# EAGLE design ECE411 Haptic Compass (EAGLE 9.5.1)
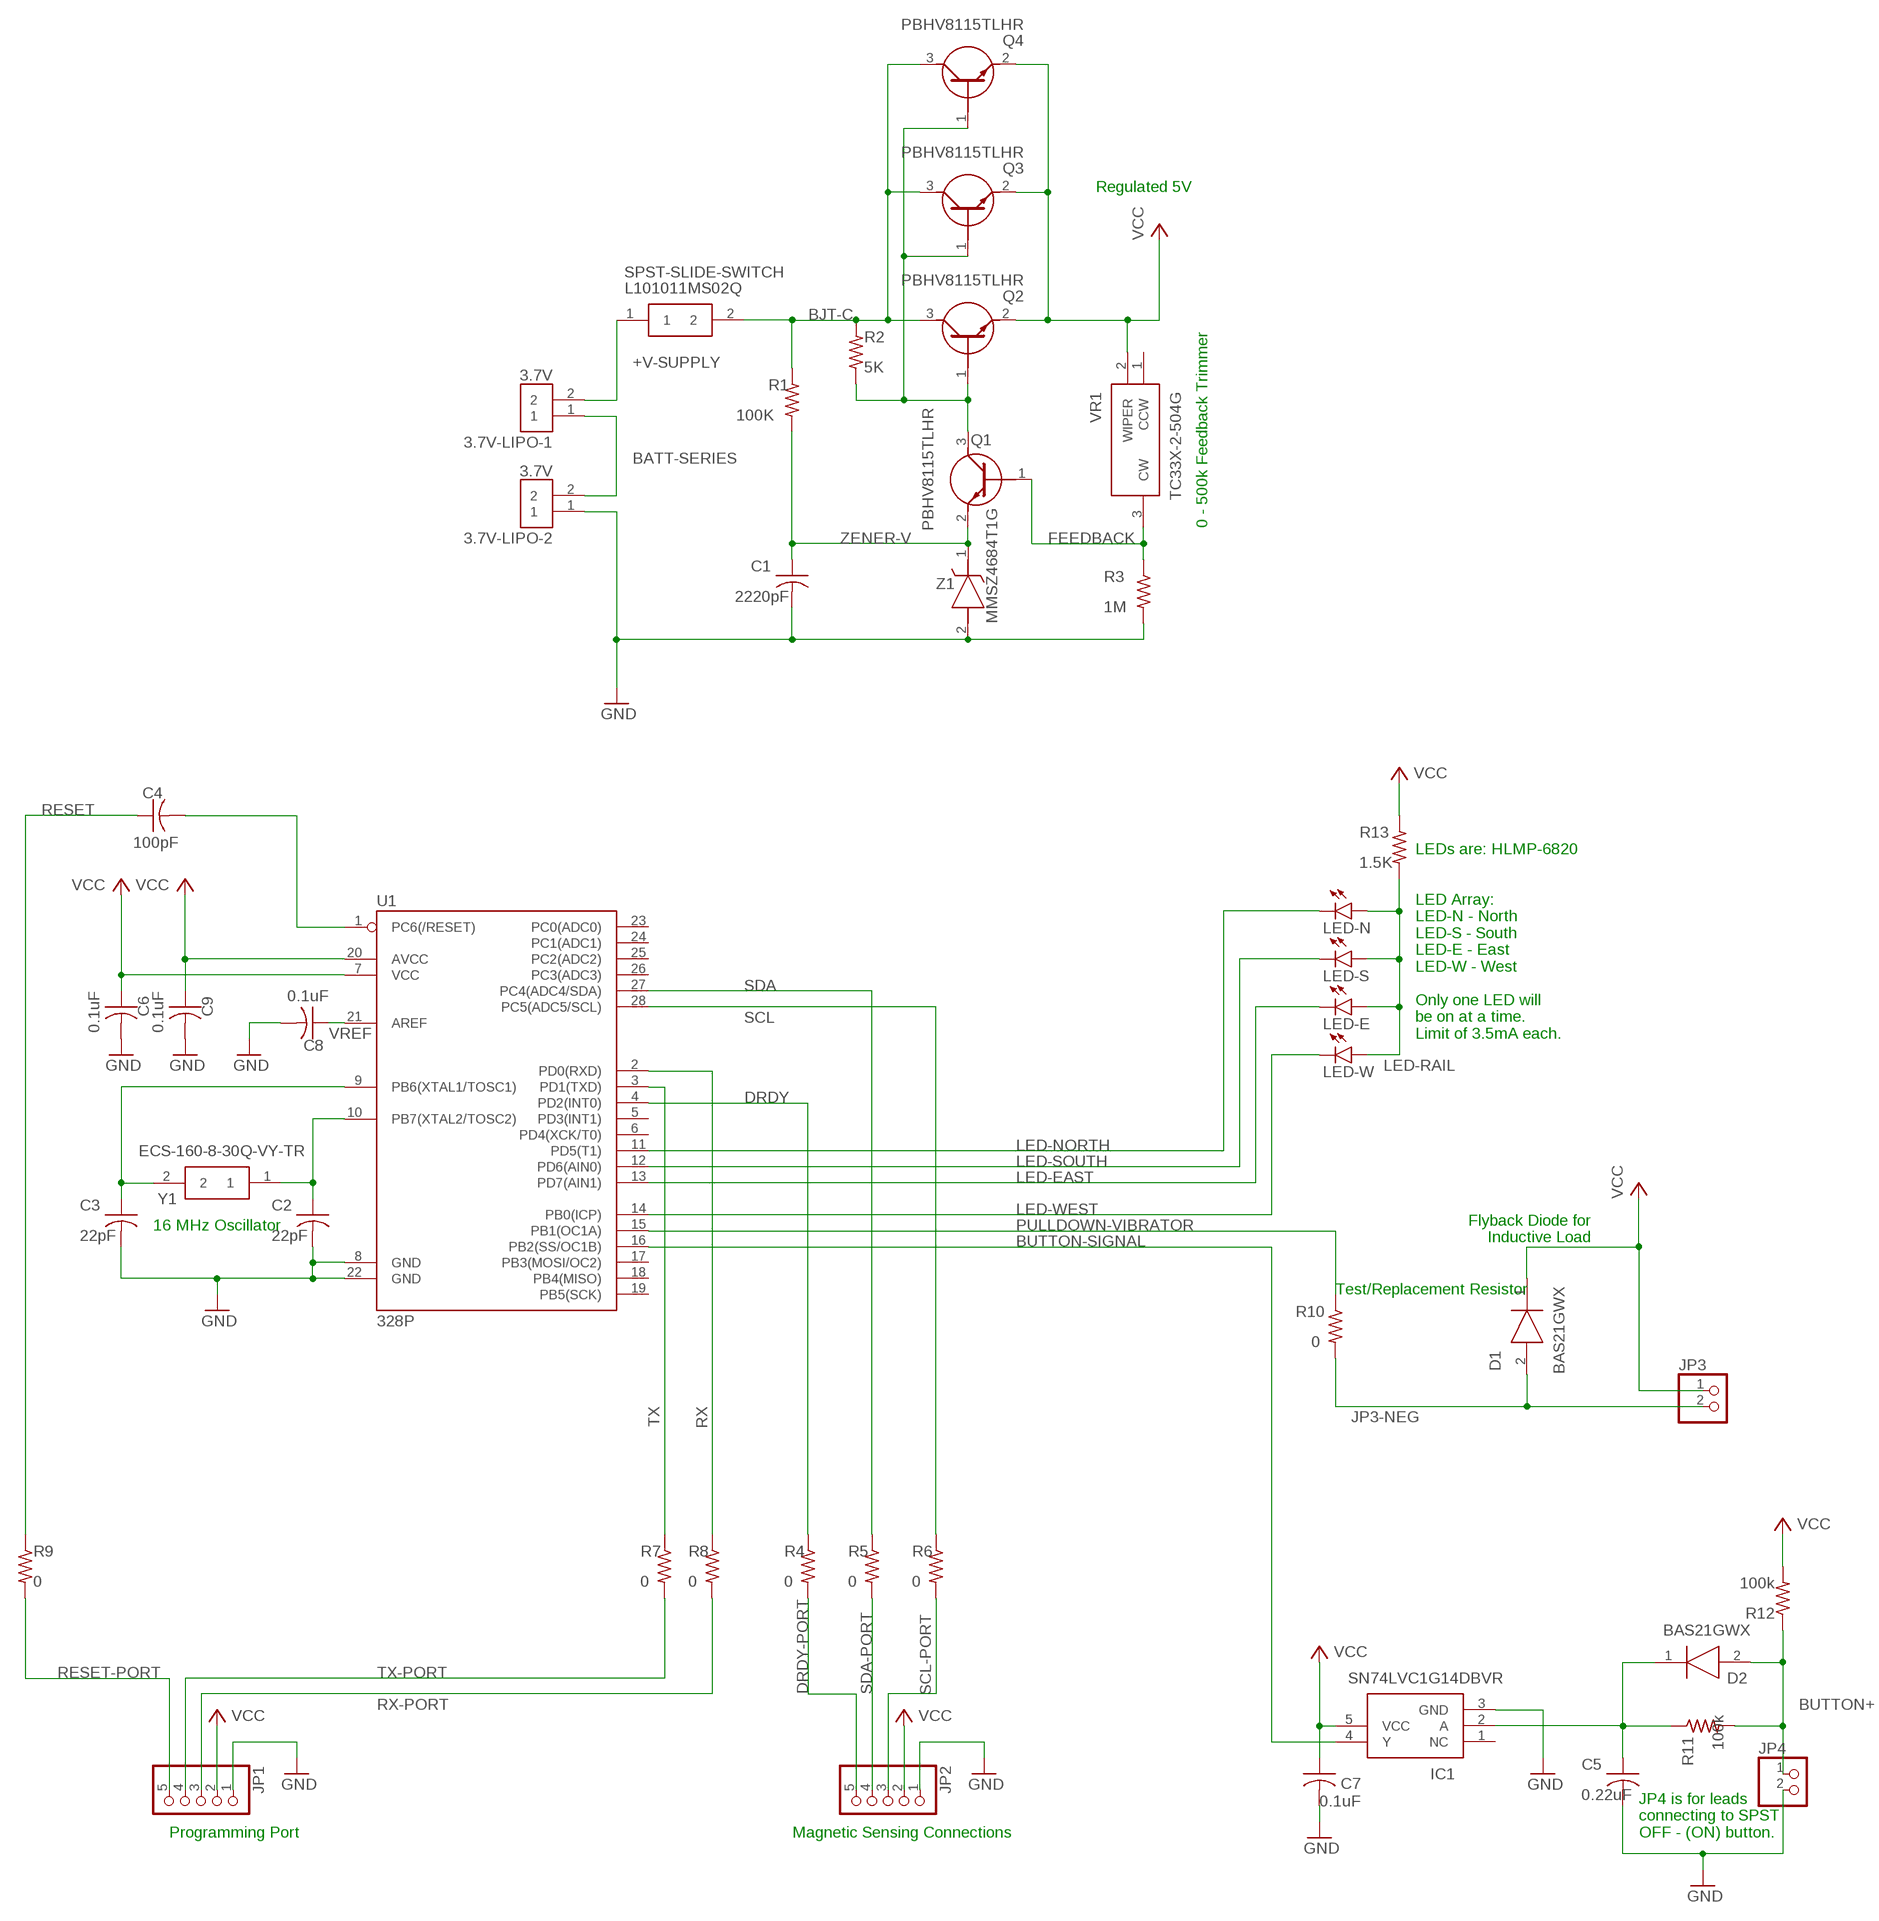
[diagram p0: schematic, sheet 1]

## Parts
3.7V-LIPO-1  3.7V  S2B-PH-K-S(LF)(SN)  [JST_S2B-PH-K-S(LF)(SN)]
3.7V-LIPO-2  3.7V  S2B-PH-K-S(LF)(SN)  [JST_S2B-PH-K-S(LF)(SN)]
C1  2220pF  C-USC0805  [C0805]
C2  22pF  C-USC0805  [C0805]
C3  22pF  C-USC0805  [C0805]
C4  100pF  C-USC0805  [C0805]
C5  0.22uF  C-USC0805  [C0805]
C6  0.1uF  C-USC0805  [C0805]
C7  0.1uF  C-USC0805  [C0805]
C8  0.1uF  C-USC0805  [C0805]
C9  0.1uF  C-USC0805  [C0805]
D1  BAS21GWX  [SOD3616X130N]
D2  BAS21GWX  [SOD3616X130N]
IC1  SN74LVC1G14DBVR  [SOT95P280X145-5N]
JP1  PINHD-1X5  [1X05]
JP2  PINHD-1X5  [1X05]
JP3  PINHD-1X2  [1X02]
JP4  PINHD-1X2  [1X02]
LED-E  LED5MM  [LED5MM]
LED-N  LED5MM  [LED5MM]
LED-S  LED5MM  [LED5MM]
LED-W  LED5MM  [LED5MM]
Q1  PBHV8115TLHR  [SOT95P230X110-3N]
Q2  PBHV8115TLHR  [SOT95P230X110-3N]
Q3  PBHV8115TLHR  [SOT95P230X110-3N]
Q4  PBHV8115TLHR  [SOT95P230X110-3N]
R1  100K  R-US_R0805  [R0805]
R2  5K  R-US_R0805  [R0805]
R3  1M  R-US_R0805  [R0805]
R4  0  R-US_R0805  [R0805]
R5  0  R-US_R0805  [R0805]
R6  0  R-US_R0805  [R0805]
R7  0  R-US_R0805  [R0805]
R8  0  R-US_R0805  [R0805]
R9  0  R-US_R0805  [R0805]
R10  0  R-US_R0805  [R0805]
R11  100k  R-US_R0805  [R0805]
R12  100k  R-US_R0805  [R0805]
R13  1.5K  R-US_R0805  [R0805]
SPST-SLIDE-SWITCH  L101011MS02Q  [CKC5106-ND]
U1  328P  ATMEGA328P_PDIP  [DIP28]
VR1  TC33X-2-504G  [TC33X-2_1]
Y1  ECS-160-8-30Q-VY-TR  [ECS80830QVSTR]
Z1  MMSZ4684T1G  [SOD3716X135N]

## Nets
+V-SUPPLY: 3.7V-LIPO-1.2 SPST-SLIDE-SWITCH.1
BATT-SERIES: 3.7V-LIPO-1.1 3.7V-LIPO-2.2
BJT-C: Q2.3(C) Q3.3(C) Q4.3(C) R1.1 R2.1 SPST-SLIDE-SWITCH.2
BUTTON+: D2.2(A) JP4.1 R11.2 R12.1
BUTTON-SIGNAL: IC1.4(Y) U1.16(PB2(SS/OC1B))
DRDY: R4.1 U1.4(PD2(INT0))
DRDY-PORT: JP2.5 R4.2
FEEDBACK: Q1.1(B) R3.1 VR1.3(CW)
GND: 3.7V-LIPO-2.1 C1.2 C2.2 C3.2 C5.2 C6.2 C7.2 C8.2 C9.2 IC1.3(GND) JP1.1 JP2.1 JP4.2 R3.2 U1.8(GND) U1.22(GND) Z1.2(A)
JP3-NEG: D1.2(A) JP3.2 R10.2
LED-EAST: LED-E.K(C) U1.13(PD7(AIN1))
LED-NORTH: LED-N.K(C) U1.11(PD5(T1))
LED-RAIL: LED-E.A LED-N.A LED-S.A LED-W.A R13.2
LED-SOUTH: LED-S.K(C) U1.12(PD6(AIN0))
LED-WEST: LED-W.K(C) U1.14(PB0(ICP))
N$1: C4.2 U1.1(PC6(/RESET))
N$3: C5.1 D2.1(K) IC1.2(A) R11.1
N$5: C2.1 U1.10(PB7(XTAL2/TOSC2)) Y1.1
N$7: C3.1 U1.9(PB6(XTAL1/TOSC1)) Y1.2
N$9: Q1.3(C) Q2.1(B) Q3.1(B) Q4.1(B) R2.2
PULLDOWN-VIBRATOR: R10.1 U1.15(PB1(OC1A))
RESET: C4.1 R9.1
RESET-PORT: JP1.5 R9.2
RX: R8.1 U1.2(PD0(RXD))
RX-PORT: JP1.3 R8.2
SCL: R6.1 U1.28(PC5(ADC5/SCL))
SCL-PORT: JP2.3 R6.2
SDA: R5.1 U1.27(PC4(ADC4/SDA))
SDA-PORT: JP2.4 R5.2
TX: R7.1 U1.3(PD1(TXD))
TX-PORT: JP1.4 R7.2
VCC: C6.1 C7.1 C9.1 D1.1(K) IC1.5(VCC) JP1.2 JP2.2 JP3.1 Q2.2(E) Q3.2(E) Q4.2(E) R12.2 R13.1 U1.7(VCC) U1.20(AVCC) VR1.2(WIPER)
VREF: C8.1 U1.21(AREF)
ZENER-V: C1.1 Q1.2(E) R1.2 Z1.1(K)
Unconnected: IC1.1(NC) U1.5(PD3(INT1)) U1.6(PD4(XCK/T0)) U1.17(PB3(MOSI/OC2)) U1.18(PB4(MISO)) U1.19(PB5(SCK)) U1.23(PC0(ADC0)) U1.24(PC1(ADC1)) U1.25(PC2(ADC2)) U1.26(PC3(ADC3)) VR1.1(CCW)

## Notes on the sheet
- Regulated 5V
- 0 - 500k Feedback Trimmer
- LEDs are: HLMP-6820
  
  
  LED Array:
  LED-N - North
  LED-S - South
  LED-E - East
  LED-W - West
  
  Only one LED will
  be on at a time.
  Limit of 3.5mA each.
- Flyback Diode for
  Inductive Load
- 16 MHz Oscillator
- Test/Replacement Resistor
- Programming Port | Magnetic Sensing Connections
- JP4 is for leads
  connecting to SPST
  OFF - (ON) button.

## Library data of the parts
3.7V-LIPO-1 3.7V-LIPO-2 = S2B-PH-K-S_LF__SN_:S2B-PH-K-S(LF)(SN): PH Series 2 Position 2.0 mm Through Hole Side Entry Shrouded Header; DESCRIPTION: PH Series 2 Position 2.0 mm Through Hole Side Entry Shrouded Header; DIGI-KEY_PART_NUMBER: 455-1719-ND; DIGI-KEY_PURCHASE_URL: https://www.digikey.com/product-detail/en/jst-sales-america-inc/S2B-PH-K-S_LF__SN_/455-1719-ND/926626?utm_source=snapeda&utm_medium=aggregator&utm_campaign=symbol; MF: JST Sales; MP: S2B-PH-K-S_LF__SN_; PACKAGE: None
C1-C9 = rcl:C-US: CAPACITOR, American symbol; SPICEPREFIX: C
D1 D2 = SamacSys_Parts:BAS21GWX: Diodes - General Purpose, Power, Switching High-voltage switching diode - 3k Reel Source: Datasheet <https://componentsearchengine.com/Datasheets/1/BAS21GWX.pdf>; DESCRIPTION: Diodes - General Purpose, Power, Switching High-voltage switching diode - 3k Reel; HEIGHT: 1.3mm; MANUFACTURER_NAME: Nexperia; MANUFACTURER_PART_NUMBER: BAS21GWX; MOUSER_PART_NUMBER: 841-BAS21GWX; MOUSER_PRICE-STOCK: https://www.mouser.com/Search/Refine.aspx?Keyword=841-BAS21GWX
IC1 = SamacSys_Parts:SN74LVC1G14DBVR: TEXAS INSTRUMENTS - SN74LVC1G14DBVR - IC, SCHMITT TRIGGER INVERTER, SMD Source: Datasheet; DESCRIPTION: TEXAS INSTRUMENTS - SN74LVC1G14DBVR - IC, SCHMITT TRIGGER INVERTER, SMD; HEIGHT: 1.45mm; MANUFACTURER_NAME: Texas Instruments; MANUFACTURER_PART_NUMBER: SN74LVC1G14DBVR; MOUSER_PART_NUMBER: 595-SN74LVC1G14DBVR; MOUSER_PRICE-STOCK: https://www.mouser.com/Search/Refine.aspx?Keyword=595-SN74LVC1G14DBVR
JP1 JP2 = pinhead:PINHD-1X5: PIN HEADER
JP3 JP4 = pinhead:PINHD-1X2: PIN HEADER
LED-E LED-N LED-S LED-W = led:LED: LED OSRAM: - CHIPLED LG R971, LG N971, LY N971, LG Q971, LY Q971, LO R971, LY R971 LH N974, LH R974 LS Q976, LO Q976, LY Q976 LO Q996 - Hyper CHIPLED LW Q18S LB Q993, LB Q99A, LB R99A - SideLED LS A670, LO A670, LY A670, LG A670, LP A670 LB A673, LV A673, LT A673, LW A673 LH A674 LY A675 LS A676, LA A676, LO A676, LY A676, LW A676 LS A679, LY A679, LG A679 - Hyper Micro SIDELED® LS Y876, LA Y876, LO Y876, LY Y876 LT Y87S - SmartLED LW L88C, LW L88S LB L89C, LB L89S, LG L890 LS L89K, LO L89K, LY L89K LS L896, LA L896, LO L896, LY L896 - TOPLED LS T670, LO T670, LY T670, LG T670, LP T670 LSG T670, LSP T670, LSY T670, LOP T670, LYG T670 LG T671, LOG T671, LSG T671 LB T673, LV T673, LT T673, LW T673 LH T674 LS T676, LA T676, LO T676, LY T676, LB T676, LH T676, LSB T676, LW T676 LB T67C, LV T67C, LT T67C, LS T67K, LO T67K, LY T67K, LW E67C LS E67B, LA E67B, LO E67B, LY E67B, LB E67C, LV E67C, LT E67C LW T67C LS T679, LY T679, LG T679 LS T770, LO T770, LY T770, LG T770, LP T770 LB T773, LV T773, LT T773, LW T773 LH T774 LS E675, LA E675, LY E675, LS T675 LS T776, LA T776, LO T776, LY T776, LB T776 LHGB T686 LT T68C, LB T68C - Hyper Mini TOPLED® LB M676 - Mini TOPLED Santana® LG M470 LS M47K, LO M47K, LY M47K Source: http://www.osram.convergy.de LUXEON: - LUMILED® LXK2-PW12-R00, LXK2-PW12-S00, LXK2-PW14-U00, LXK2-PW14-V00 LXK2-PM12-R00, LXK2-PM12-S00, LXK2-PM14-U00 LXK2-PE12-Q00, LXK2-PE12-R00, LXK2-PE12-S00, LXK2-PE14-T00, LXK2-PE14-U00 LXK2-PB12-K00, LXK2-PB12-L00, LXK2-PB12-M00, LXK2-PB14-N00, LXK2-PB14-P00, LXK2-PB14-Q00 LXK2-PR12-L00, LXK2-PR12-M00, LXK2-PR14-Q00, LXK2-PR14-R00 LXK2-PD12-Q00, LXK2-PD12-R00, LXK2-PD12-S00 LXK2-PH12-R00, LXK2-PH12-S00 LXK2-PL12-P00, LXK2-PL12-Q00, LXK2-PL12-R00 Source: www.luxeon.com KINGBRIGHT: KA-3528ASYC Source: www.kingbright.com
Q1-Q4 = SamacSys_Parts:PBHV8115TLHR: PBHV8115TLH - 150 V, 1 A NPN high-voltage low VCEsat BISS transistor Source: Datasheet <http://assets.nexperia.com/documents/data-sheet/PBHV8115TLH.pdf>; DESCRIPTION: PBHV8115TLH - 150 V, 1 A NPN high-voltage low VCEsat BISS transistor; HEIGHT: 1.1mm; MANUFACTURER_NAME: Nexperia; MANUFACTURER_PART_NUMBER: PBHV8115TLHR; MOUSER_PART_NUMBER: 771-PBHV8115TLHR; MOUSER_PRICE-STOCK: https://www.mouser.com/Search/Refine.aspx?Keyword=771-PBHV8115TLHR
R1-R13 = rcl:R-US_: RESISTOR, American symbol; SPICEPREFIX: R
SPST-SLIDE-SWITCH = SamacSys_Parts:L101011MS02Q: SWITCH SLIDE SPST 4A 125V Source: Datasheet <https://componentsearchengine.com/Datasheets/1/L101011MS02Q.pdf>; DESCRIPTION: SWITCH SLIDE SPST 4A 125V; HEIGHT: mm; MANUFACTURER_NAME: C & K COMPONENTS; MANUFACTURER_PART_NUMBER: L101011MS02Q; MOUSER_PART_NUMBER: 611-L101011MS02Q; MOUSER_PRICE-STOCK: https://www.mouser.com/Search/Refine.aspx?Keyword=611-L101011MS02Q
U1 = SparkFun-IC-Microcontroller:ATMEGA328P_PDIP: Atmel 328P Through hole ATMEGA328P uC used in the Arduino 32kb flash, 1k EEPROM, 2k SRAM Datasheet <http://www.sparkfun.com/datasheets/Components/SMD/ATMega328.pdf> SparkFun Products Storefront component: AVR 28 Pin 20MHz 32K 6A/D - ATMega328P <https://www.sparkfun.com/products/9061> (COM-09061) SparkFun Simon Says - Through-Hole Soldering Kit <https://www.sparkfun.com/products/10547> (KIT-10547) SparkFun Learn to Solder - Simon Says <https://www.sparkfun.com/products/13708> (KIT-13708) SparkFun BigTime Watch Kit <https://www.sparkfun.com/products/11734> (KIT-11734) SparkFun ClockIt <https://www.sparkfun.com/products/10930> (KIT-10930) SparkFun Serial Enabled LCD Kit <https://www.sparkfun.com/products/10097> (LCD-10097) SparkFun Simon Tilts - Through Hole Soldering Kit <https://www.sparkfun.com/products/12634> (KIT-12634) SparkFun Frequency Counter Kit <https://www.sparkfun.com/products/10140> (KIT-10140) FabFM Radio Kit <https://www.sparkfun.com/products/11043> (KIT-11043) SparkFun Binary Blaster Kit <https://www.sparkfun.com/products/12037> (KIT-12037) SparkFun Metro-Gnome <https://www.sparkfun.com/products/9236> (KIT-09236) ATmega328 with Arduino Optiboot (Uno) <https://www.sparkfun.com/products/10524> (DEV-10524); PROD_ID: IC-09136
VR1 = SamacSys_Parts:TC33X-2-504G: Trimmer Resistors - SMD 3MM 500KOHMS 25% 0.1WATT OPEN FRM Source: Datasheet <https://componentsearchengine.com/Datasheets/1/TC33X-2-504G.pdf>; DESCRIPTION: Trimmer Resistors - SMD 3MM 500KOHMS 25% 0.1WATT OPEN FRM; HEIGHT: mm; MANUFACTURER_NAME: Bourns; MANUFACTURER_PART_NUMBER: TC33X-2-504G; MOUSER_PART_NUMBER: 652-TC33X-2-504G; MOUSER_PRICE-STOCK: https://www.mouser.com/Search/Refine.aspx?Keyword=652-TC33X-2-504G
Y1 = SamacSys_Parts:ECS-160-8-30Q-VY-TR: Crystals 16MHz 8pF AEC ESR 50 -40C +150C Source: Datasheet <https://componentsearchengine.com/Datasheets/1/ECS-160-8-30Q-VY-TR.pdf>; DESCRIPTION: Crystals 16MHz 8pF AEC ESR 50 -40C +150C; HEIGHT: 1.1mm; MANUFACTURER_NAME: ECS; MANUFACTURER_PART_NUMBER: ECS-160-8-30Q-VY-TR; MOUSER_PART_NUMBER: 520-160-8-30Q-VYT; MOUSER_PRICE-STOCK: https://www.mouser.com/Search/Refine.aspx?Keyword=520-160-8-30Q-VYT
Z1 = SamacSys_Parts:MMSZ4684T1G: ON Semiconductor MMSZ4684T1G Zener Diode, 3.3V 5% 0.5 W SMT 2-Pin SOD-123 Source: Datasheet <https://componentsearchengine.com/Datasheets/1/MMSZ4684T1G.pdf>; DESCRIPTION: ON Semiconductor MMSZ4684T1G Zener Diode, 3.3V 5% 0.5 W SMT 2-Pin SOD-123; HEIGHT: 1.35mm; MANUFACTURER_NAME: ON Semiconductor; MANUFACTURER_PART_NUMBER: MMSZ4684T1G; MOUSER_PART_NUMBER: 863-MMSZ4684T1G; MOUSER_PRICE-STOCK: https://www.mouser.com/Search/Refine.aspx?Keyword=863-MMSZ4684T1G

## Board
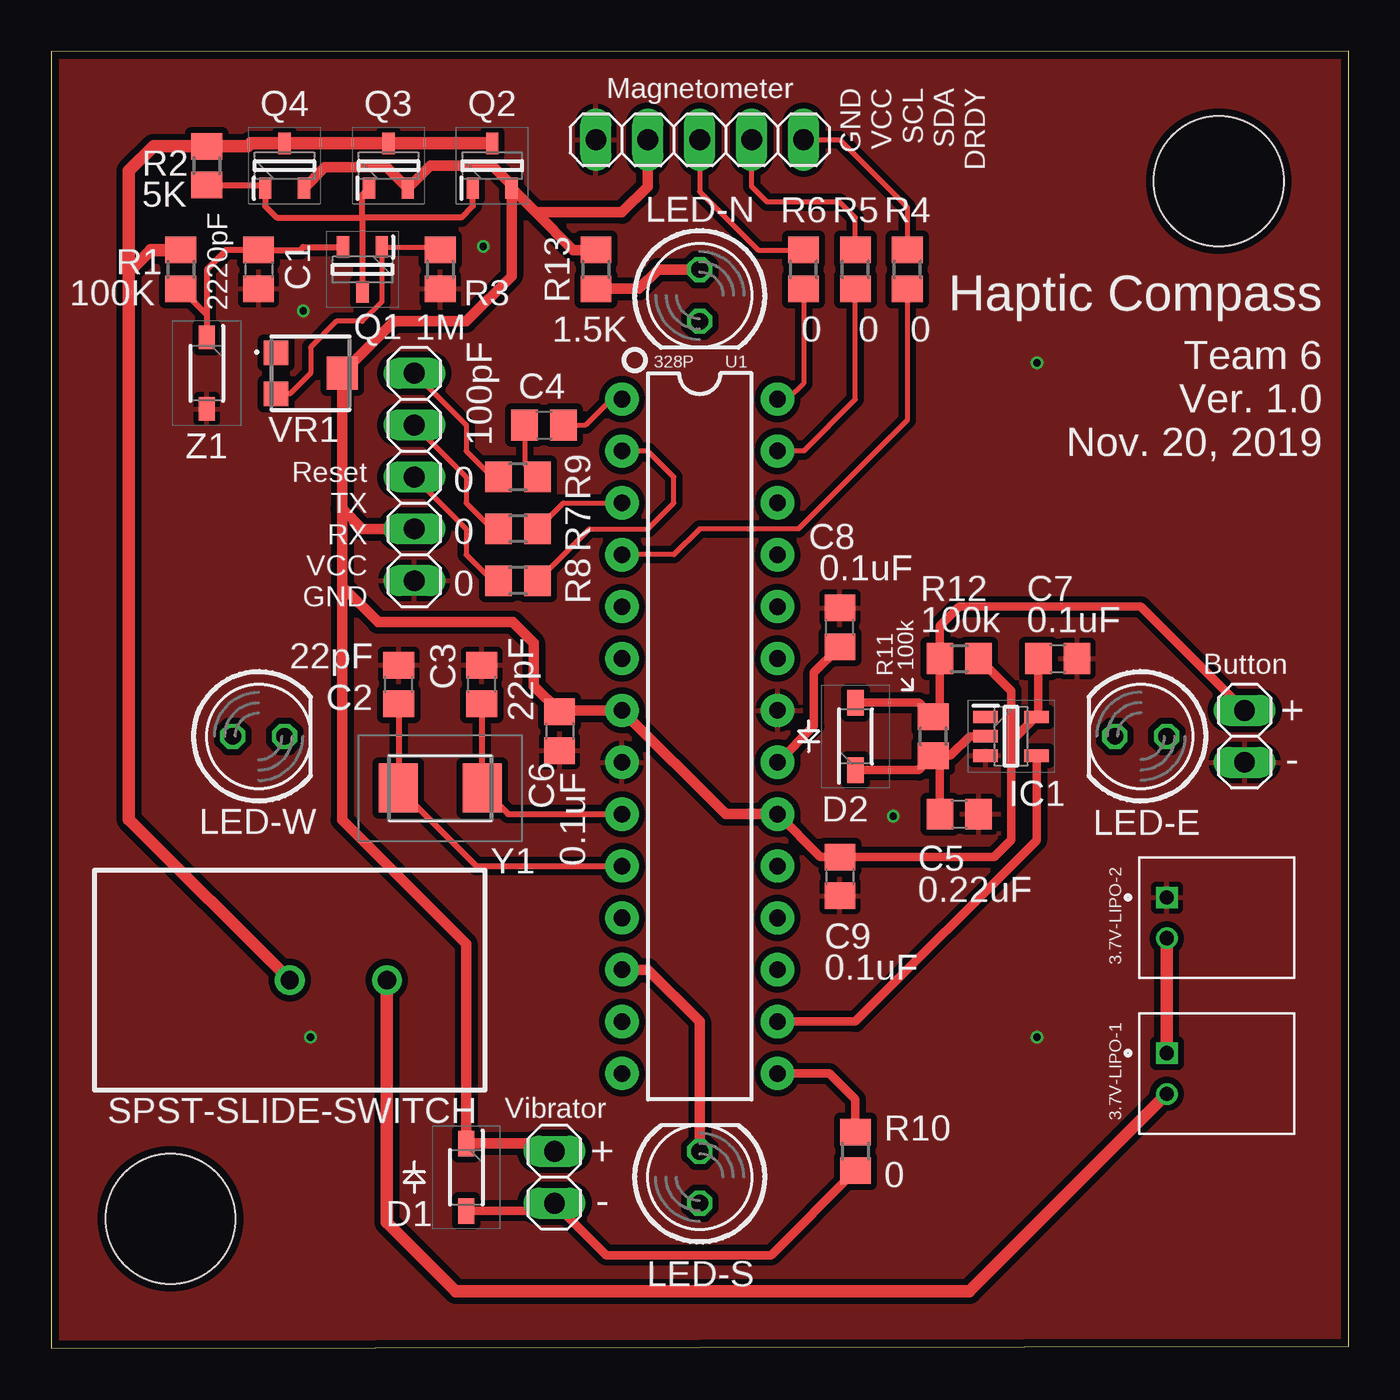
[diagram p1: board, top side]
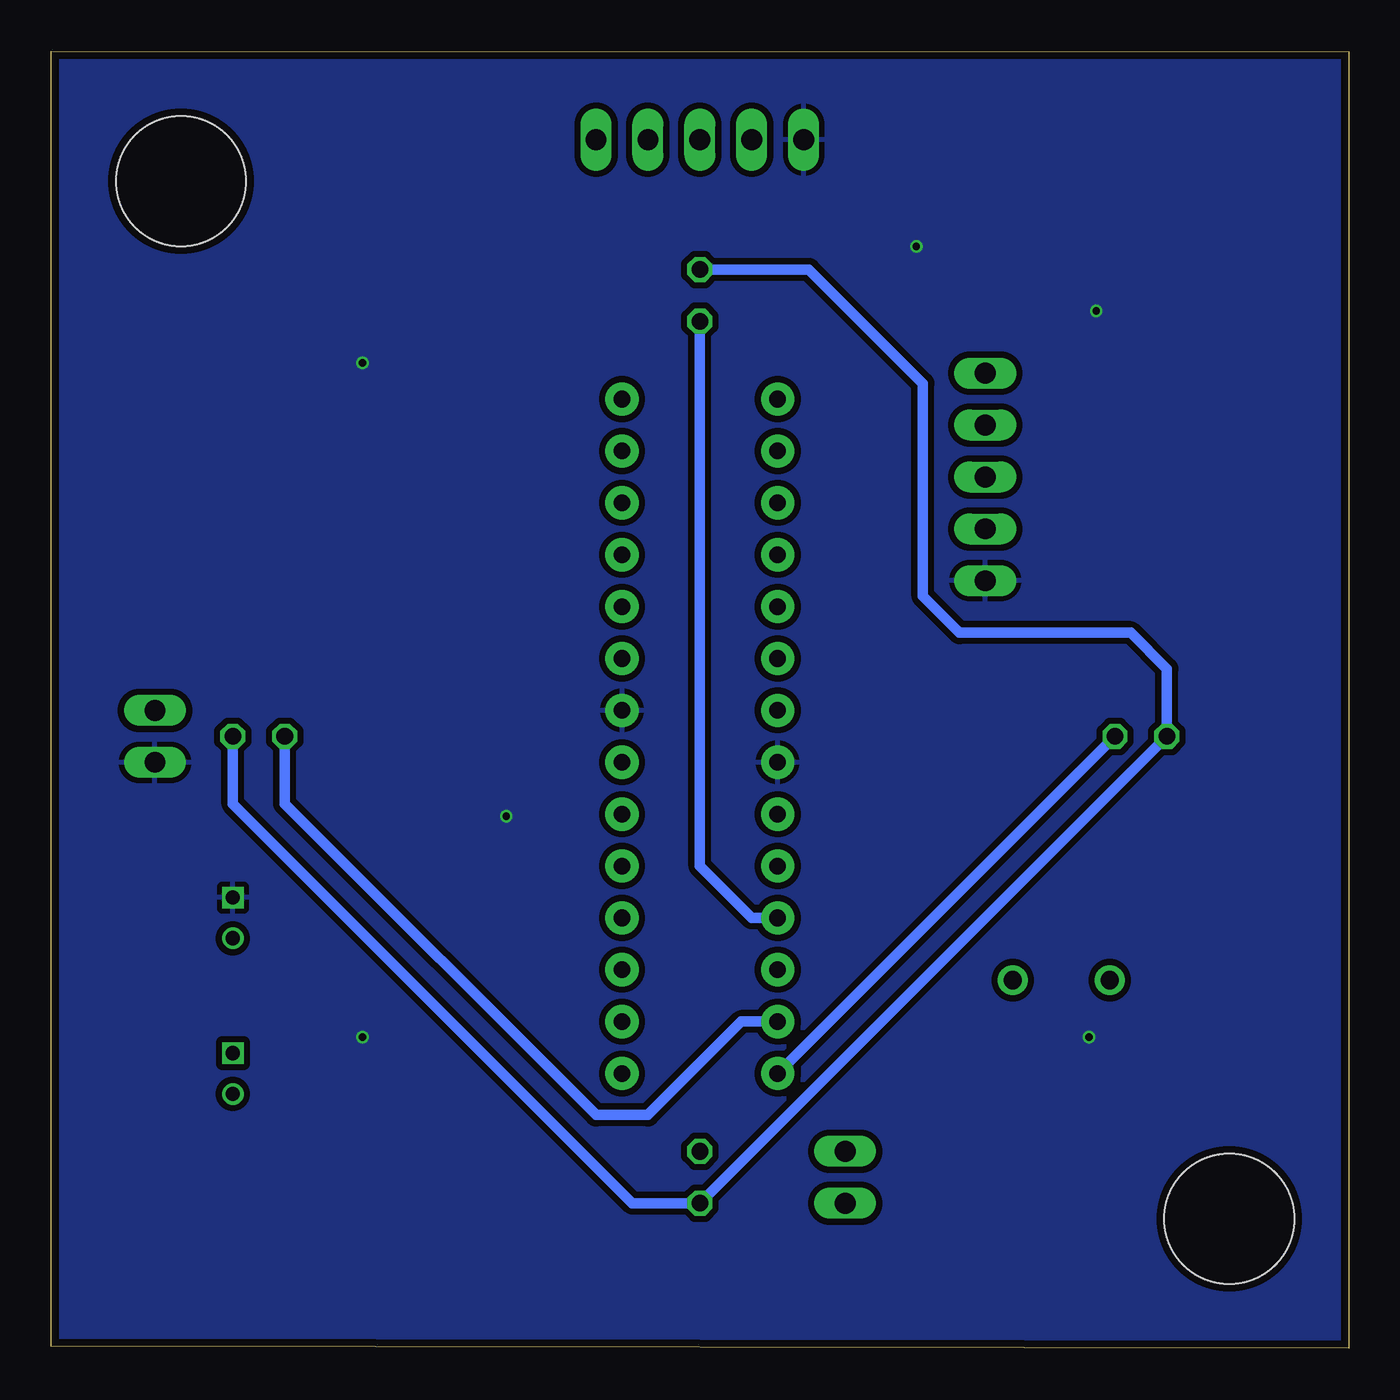
[diagram p2: board, bottom side, seen from below]

Size 63.51 x 63.53 mm. Coordinates in mm from the lower left corner, seen from the top.
Outline: 0,0 63.51,0.1 63.51,63.53 0,63.5 0,0
Copper layers (1*16): Top 0.035559375mm / dielectric 1.6mm / Bottom 0.035559375mm
Design rules "OSHPARK": minimum track width 6mil, minimum drill 10mil, track to track 6mil, track to pad 6mil, pad to pad 6mil, via to via 6mil, smd to smd 6mil, copper to edge 15mil, drill to drill 6mil, minimum pad ring 5mil, minimum via ring 5mil, stop-mask expansion 2.5mil, vias tented up to drill 0mil, thermal gap 10mil
Holes 6.35 mm at 57.15,57.15 5.84,6.35

### Footprints (pad centres in the part's own frame; a part is rotated, then mirrored left to right if it is on the bottom)
JST_S2B-PH-K-S(LF)(SN) = drill 0.7 square: 1 1,0 | drill 0.7: 2 -1,0
C0805 = smd 1.3 x 1.5: 1 -0.95,0; 2 0.95,0
SOD3616X130N = smd 1.25 x 0.8: 1 -1.65,0; 2 1.65,0
SOT95P280X145-5N = smd 1.2 x 0.6: 1 -1.25,0.95; 2 -1.25,0; 3 -1.25,-0.95; 4 1.25,-0.95; 5 1.25,0.95
1X05 = drill 1.016 long: 1 -5.08,0; 2 -2.54,0; 3 0,0; 4 2.54,0; 5 5.08,0
1X02 = drill 1.016 long: 1 -1.27,0; 2 1.27,0
LED5MM = drill 0.813 octagon: A -1.27,0; K 1.27,0
SOT95P230X110-3N = smd 1.05 x 0.6: 1 -1.1,0.95; 2 -1.1,-0.95; 3 1.1,0
R0805 = smd 1.3 x 1.5: 1 -0.95,0; 2 0.95,0
CKC5106-ND = drill 0.9 pad 1.45: 1 0,-4.75; 2 0,0
DIP28 = drill 0.813 pad 1.626: 1 -16.51,-3.81; 2 -13.97,-3.81; 3 -11.43,-3.81; 4 -8.89,-3.81; 5 -6.35,-3.81; 6 -3.81,-3.81; 7 -1.27,-3.81; 8 1.27,-3.81; 9 3.81,-3.81; 10 6.35,-3.81; 11 8.89,-3.81; 12 11.43,-3.81; 13 13.97,-3.81; 14 16.51,-3.81; 15 16.51,3.81; 16 13.97,3.81; 17 11.43,3.81; 18 8.89,3.81; 19 6.35,3.81; 20 3.81,3.81; 21 1.27,3.81; 22 -1.27,3.81; 23 -3.81,3.81; 24 -6.35,3.81; 25 -8.89,3.81; 26 -11.43,3.81; 27 -13.97,3.81; 28 -16.51,3.81
TC33X-2_1 = smd 1.2 x 1.2: 1 -1,-1.7; 3 1,-1.7 | smd 1.6 x 1.5: 2 0,1.55
ECS80830QVSTR = smd 1.9 x 2.4: 1 -2.05,0; 2 2.05,0
SOD3716X135N = smd 1.15 x 0.8: 1 -1.75,0; 2 1.75,0

### Placement (x,y rotation side)
3.7V-LIPO-1  54.61,13.46 90 top
3.7V-LIPO-2  54.61,21.08 90 top
C1  10.16,52.83 270 top
C2  17.02,32.51 90 top
C3  21.08,32.51 90 top
C4  24.13,45.21 0 top
C5  44.45,26.16 0 top
C6  24.89,30.23 270 top
C7  49.28,33.78 0 top
C8  38.61,35.31 90 top
C9  38.61,23.11 270 top
D1  20.32,8.38 270 top
D2  39.37,29.97 90 top
IC1  46.99,29.97 0 top
JP1  17.78,42.67 90 top
JP2  31.75,59.18 0 top
JP3  24.64,8.38 270 top
JP4  58.42,29.97 270 top
LED-E  53.34,29.97 180 top
LED-N  31.75,51.56 270 top
LED-S  31.75,8.38 90 top
LED-W  10.16,29.97 0 top
Q1  15.24,52.83 270 top
Q2  21.59,57.91 90 top
Q3  16.51,57.91 90 top
Q4  11.43,57.91 90 top
R1  6.35,52.83 270 top
R2  7.62,57.91 270 top
R3  19.05,52.83 270 top
R4  41.91,52.83 90 top
R5  39.37,52.83 90 top
R6  36.83,52.83 90 top
R7  22.86,40.13 180 top
R8  22.86,37.59 180 top
R9  22.86,42.67 180 top
R10  39.37,9.65 270 top
R11  43.18,29.97 90 top
R12  44.45,33.78 0 top
R13  26.67,52.83 270 top
SPST-SLIDE-SWITCH  11.68,18.03 90 top
U1  31.75,29.97 270 top
VR1  12.7,47.75 270 top
Y1  19.05,27.43 0 top
Z1  7.62,47.75 270 top

### Tracks (layer width: path | path; a pad name or v marks a point on that pad's centre or on a via)
+V-SUPPLY
  Top 0.61: 3.7V-LIPO-1.2 44.94,2.79 19.81,2.79 16.43,6.17 SPST-SLIDE-SWITCH.1
BATT-SERIES
  Top 0.152: 54.61,19.81 3.7V-LIPO-2.2
  Top 0.61: 3.7V-LIPO-1.1 54.61,19.81
BJT-C
  Top 0.61: Q2.3 Q3.3 Q4.3 9.78,59.01 9.63,58.86 R2.1 5.01,58.86 3.81,57.66 3.81,52.7 | R1.1 4.89,53.78 3.81,52.7 | 3.81,52.7 3.81,25.91 SPST-SLIDE-SWITCH.2
BUTTON+
  Top 0.406: D2.2 42.48,31.62 R11.2 43.5,31.24 R12.1 43.5,35.37 44.45,36.32 53.34,36.32 JP4.1
BUTTON-SIGNAL
  Top 0.406: IC1.4 48.24,24.87 39.37,16 U1.16
DRDY
  Top 0.254: R4.1 41.91,45.47 36.58,40.13 31.75,40.13 30.48,38.86 U1.4
DRDY-PORT
  Top 0.254: JP2.5 38.61,59.18 41.91,55.88 R4.2
FEEDBACK
  Top 0.254: VR1.3 11.7,46.75 12.7,47.75 12.7,49.02 13.97,50.29 15.24,50.29 16.19,51.24 Q1.1 18.9,53.93 R3.1
GND  (via drill 0.35)
  other vias: 21.15,53.96 12.34,50.8 48.26,48.26 41.22,26.06 48.26,15.24 12.7,15.24
  pour Top (isolate 0.305): 0,63.5 63.5,63.5 63.5,0 0,0
  pour Bottom (isolate 0.305): 0,63.5 63.5,63.5 63.5,0 0,0
JP3-NEG
  Top 0.406: R10.2 35.24,4.57 27.18,4.57 JP3.2 24.26,6.73 D1.2
LED-EAST
  Bottom 0.508: U1.13 29.72,16 34.29,11.43 36.83,11.43 52.07,26.67 LED-E.K
LED-NORTH
  Bottom 0.508: U1.11 29.21,21.08 31.75,23.62 LED-N.K
LED-RAIL
  Top 0.508: R13.2 28.77,51.88 29.72,52.83 LED-N.A
  Bottom 0.508: LED-N.A 26.42,52.83 20.83,47.24 20.83,36.83 19.05,35.05 10.67,35.05 8.89,33.27 LED-W.A LED-S.A 35.05,7.11 54.61,26.67 LED-E.A
LED-SOUTH
  Top 0.508: U1.12 29.21,18.54 31.75,16 LED-S.K
LED-WEST
  Bottom 0.508: LED-W.K U1.14
N$1
  Top 0.254: C4.2 26.16,45.21 27.43,46.48 U1.1
N$3
  Top 0.406: R11.1 42.48,28.32 D2.1 | C5.1 43.5,28.7 R11.1 | R11.1 44.01,29.02 44.96,29.97 IC1.2
N$5
  Top 0.305: U1.10 20.81,23.62 Y1.1 17.02,27.45 C2.1
N$7
  Top 0.305: U1.9 22.37,26.16 Y1.2 21.08,27.45 C3.1
N$9
  Top 0.152: 15.31,56.57 Q3.1
  Top 0.305: R2.2 10.33,56.96 Q4.1 10.48,55.94 11.05,55.37 15.24,55.37 | 15.24,55.37 15.24,56.49 15.31,56.57 | 15.24,55.37 20.07,55.37 20.64,55.95 Q2.1 | 15.24,55.37 Q1.3
PULLDOWN-VIBRATOR
  Top 0.406: U1.15 38.1,13.46 39.37,12.19 R10.1
RESET
  Top 0.254: C4.1 23.18,43.3 R9.1
RESET-PORT
  Top 0.254: JP1.5 20.32,45.21 20.32,43.94 21.59,42.67 R9.2
RX
  Top 0.254: R8.1 26.35,40.13 29.21,40.13 30.48,41.4 30.48,42.67 29.21,43.94 U1.2
RX-PORT
  Top 0.254: JP1.3 20.32,40.13 20.32,38.86 21.59,37.59 R8.2
SCL
  Top 0.254: R6.1 36.83,47.24 36.07,46.48 U1.28
SCL-PORT
  Top 0.254: JP2.3 31.75,56.64 34.61,53.78 R6.2
SDA
  Top 0.254: U1.27 36.83,43.94 39.37,46.48 R5.1
SDA-PORT
  Top 0.254: R5.2 39.37,55.37 38.61,56.13 35.05,56.13 34.29,56.9 JP2.4
TX
  Top 0.254: R7.1 25.08,41.4 U1.3
TX-PORT
  Top 0.254: JP1.4 20.32,42.67 20.32,41.4 21.59,40.13 R7.2
VCC
  Top 0.406: R12.2 46.99,32.19 46.99,29.72 | 46.99,29.72 46.99,24.89 46.16,24.06 C9.1 37.66,24.06 U1.20 | 46.99,29.72 48.19,30.92 | 48.19,30.92 IC1.5 | C7.1 48.33,31.05 48.19,30.92
  Top 0.508: Q4.2 13.4,57.84 16.43,57.84 Q3.2 18.56,57.91 21.59,57.91 22.54,56.96 Q2.2 | 14.25,41.12 VR1.2 16.79,50.29 20.32,50.29 22.54,52.51 Q2.2 | 14.25,41.12 15.24,40.13 JP1.2 | 14.25,41.12 14.25,37.31 | 14.25,37.31 16,35.56 22.61,35.56 23.62,34.54 23.62,32.45 C6.1 24.96,31.24 U1.7 33.02,26.16 U1.20 | 14.25,37.31 14.25,25.88 20.32,19.81 D1.1 24.26,10.03 JP3.1 | Q2.2 23.73,55.63 | JP2.2 29.21,56.9 27.94,55.63 23.73,55.63 | 23.73,55.63 25.57,53.78 R13.1
VREF
  Top 0.406: U1.21 37.34,30.48 37.34,33.09 C8.1
ZENER-V
  Top 0.152: 6.51,51.72 R1.2
  Top 0.305: Q1.2 12.34,53.93 12.19,53.78 C1.1 8.57,53.78 7.62,52.83 7.62,50.61 | 7.62,50.61 Z1.1 | 7.62,50.61 6.51,51.72

### Text on the board
tPlace: Haptic Compass | Team 6 / Ver. 1.0 / Nov. 20, 2019
tNames: GND / VCC / SCL / SDA / DRDY | Magnetometer | Reset / TX / RX / VCC / GND | Button | + | - | Vibrator | + | -